# EAGLE design openSX70_EDWIN_V7-9-1_20191127-TSL237T (EAGLE 9.5.1)
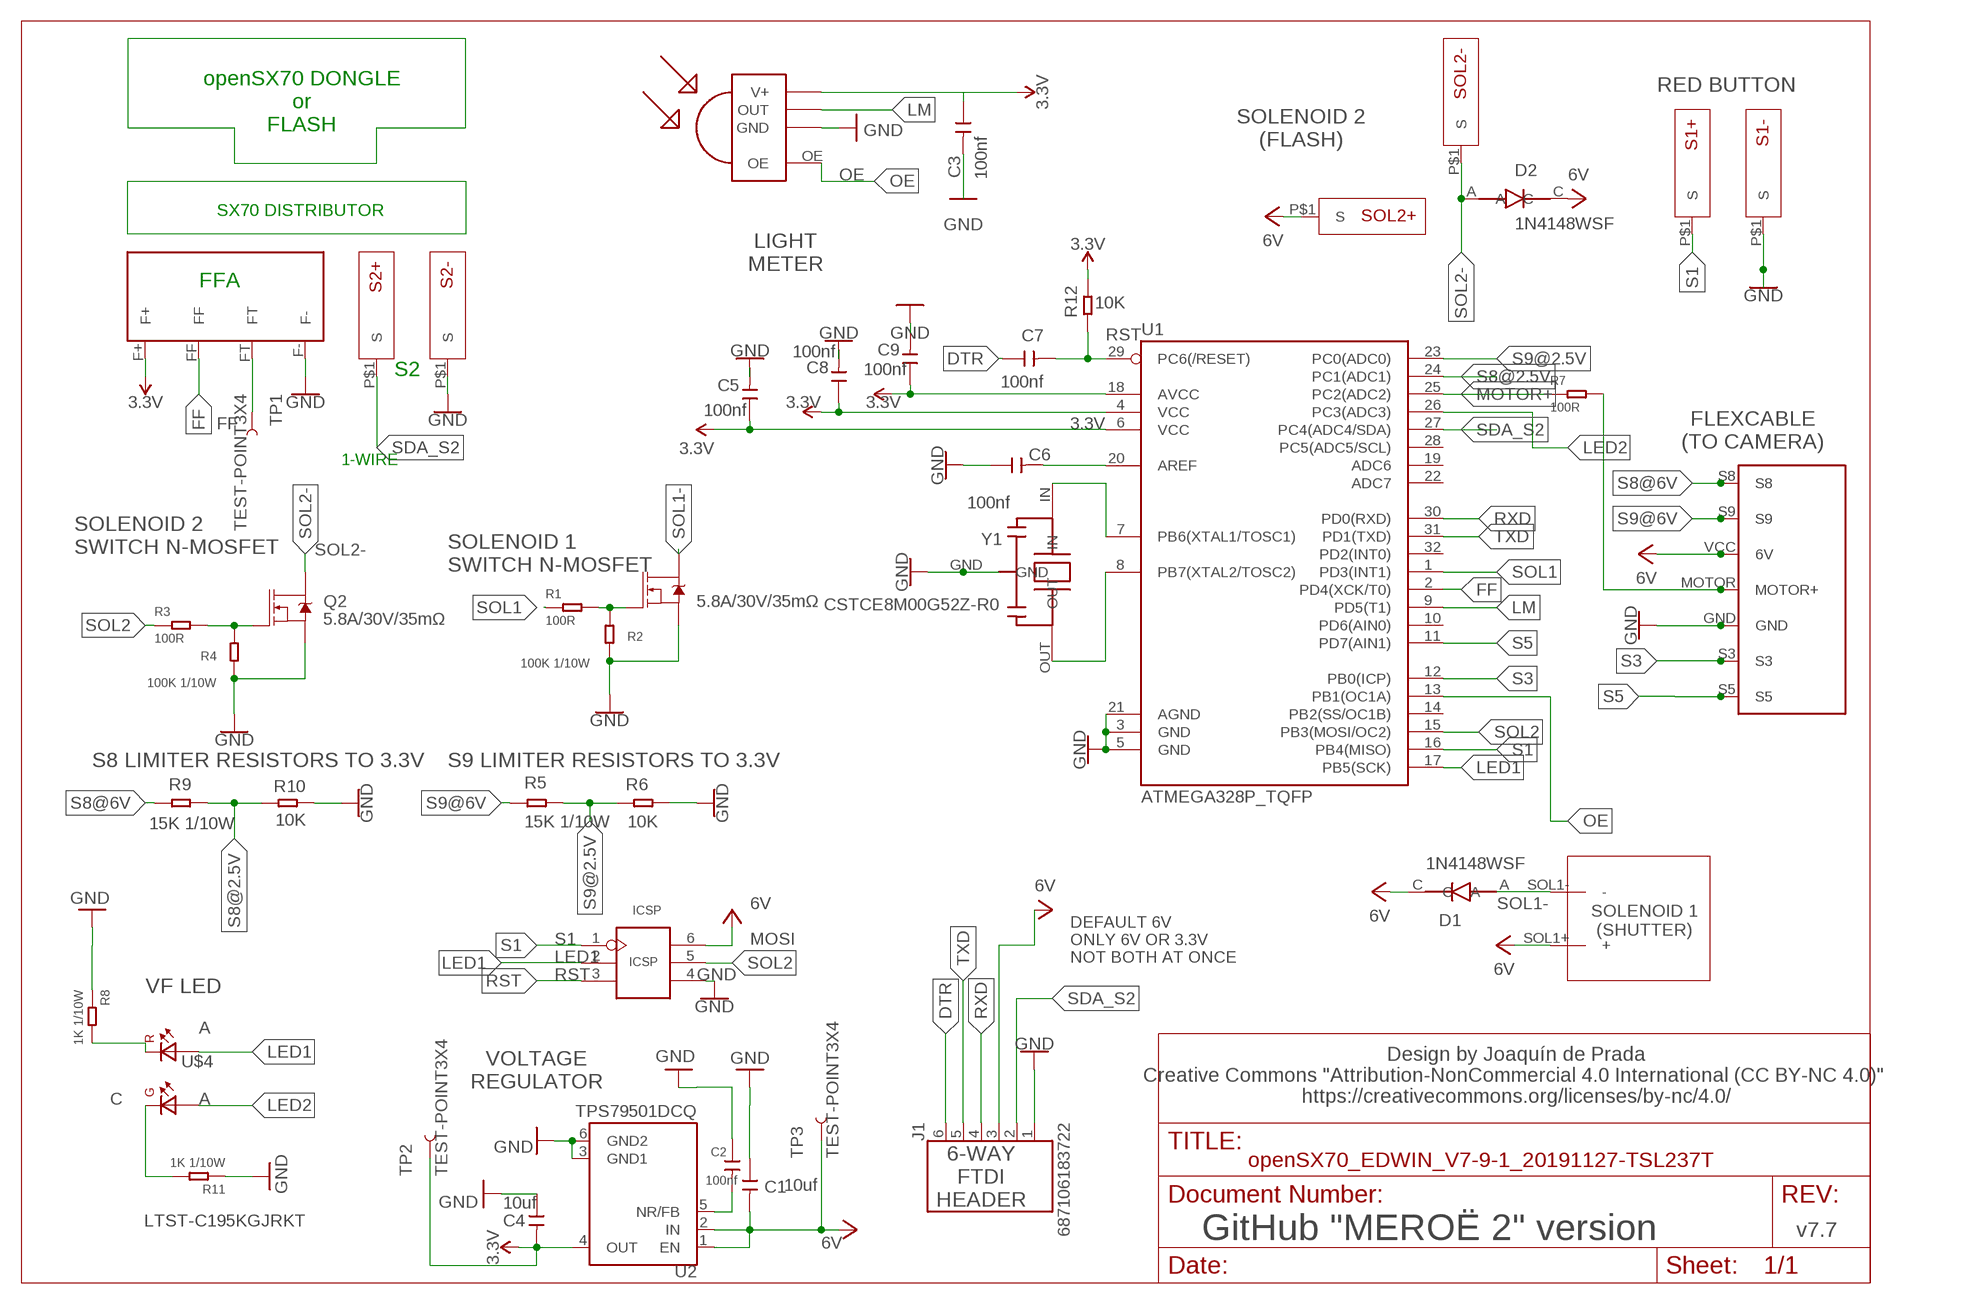
[diagram p0: schematic, sheet 1]

## Parts
C1  10uf  CERAMIC-10UF-10V-10%-X5R(0603)  [C0603]
C2  100nf  CERAMIC-100NF-50V-10%-X7R(0603)  [C0603]
C3  100nf  CERAMIC-100NF-50V-10%-X7R(0603)  [C0603]
C4  10uf  CERAMIC-10UF-10V-10%-X5R(0603)  [C0603]
C5  100nf  CERAMIC-100NF-50V-10%-X7R(0603)  [C0603]
C6  100nf  CERAMIC-100NF-50V-10%-X7R(0603)  [C0603]
C7  100nf  CERAMIC-100NF-50V-10%-X7R(0603)  [C0603]
C8  100nf  CERAMIC-100NF-50V-10%-X7R(0603)  [C0603]
C9  100nf  CERAMIC-100NF-50V-10%-X7R(0603)  [C0603]
D1  1N4148WSF  1N4148WS  [SODFL2512X100N]
D2  1N4148WSF  1N4148WS  [SODFL2512X100N]
ICSP  ICSP  [H2X3-2.54]
J1  687106183722  [687106183722]
Q1  5.8A/30V/35mΩ  MOSFET-NCH-AO3404A  [SOT23-3]
Q2  5.8A/30V/35mΩ  MOSFET-NCH-AO3404A  [SOT23-3]
R1  100R  SMD-RES-100R-5%-1/10W(0603)  [R0603]
R2  100K 1/10W  SMD-RES-100K-5%-1/10W(0603)  [R0603]
R3  100R  SMD-RES-100R-5%-1/10W(0603)  [R0603]
R4  100K 1/10W  SMD-RES-100K-5%-1/10W(0603)  [R0603]
R5  15K 1/10W  SMD-RES-15K-1%-1/10W(0603)  [R0603]
R6  10K  SMD-RES-10K-1%-1/10W(0603)  [R0603]
R7  100R  SMD-RES-100R-5%-1/10W(0603)  [R0603]
R8  1K 1/10W  SMD-RES-1K-5%-1/10W(0603)  [R0603]
R9  15K 1/10W  SMD-RES-15K-1%-1/10W(0603)  [R0603]
R10  10K  SMD-RES-10K-1%-1/10W(0603)  [R0603]
R11  1K 1/10W  SMD-RES-1K-5%-1/10W(0603)  [R0603]
R12  10K  SMD-RES-10K-1%-1/10W(0603)  [R0603]
S1+  SX70-S-PAD-NEW  [SX70-S-PAD2]
S1-  SX70-S-PAD-NEW  [SX70-S-PAD2]
S2+  SX70-S-PAD-NEW  [SX70-S-PAD2]
S2-  SX70-S-PAD-NEW  [SX70-S-PAD2]
SOL1  SX70-SOLENOID1-2PADS  [SX70-SOLENOID1-2]
SOL2+  SX70-S-PAD-NEW  [SX70-S-PAD2]
SOL2-  SX70-S-PAD-NEW  [SX70-S-PAD2]
TP1  TEST-POINT3X4  [PAD.03X.04]
TP2  TEST-POINT3X4  [PAD.03X.04]
TP3  TEST-POINT3X4  [PAD.03X.04]
U1  ATMEGA328P_TQFP  [TQFP32-08]
U2  TPS79501DCQ  [SOT127P706X180-6N]
U$1  SX70-7-PAD  [SX70-7-PAD-PROPER]
U$2  FFA  SX70-FFA-PAD  [FFA-PAD-PACKAGE]
U$3  TSL237T  [TSL237T]
U$4  LTST-C195KGJRKT  [LTST-BILED-15X16]
Y1  CSTCE8M00G52Z-R0  CSTCE16M0V53-R0  [CFP95P160X100-3N]

## Nets
3.3V: C3.1 C4.2 C5.1 C8.1 C9.1 R12.2 TP2.P$1 U1.4(VCC) U1.6(VCC) U1.18(AVCC) U2.4(OUT) U$2.F+ U$3.VDD(V+)
6V: C1.2 D1.C D2.C ICSP.6(VCC) J1.3 SOL1.SOL1+(+) SOL2+.P$1(S) TP3.P$1 U2.1(EN) U2.2(IN) U$1.VCC(6V)
DTR: C7.1 J1.6
FF: U1.2(PD4(XCK/T0)) U$2.FF
GND: C1.1 C2.1 C3.2 C4.1 C5.2 C6.1 C8.2 C9.2 ICSP.4(GND) J1.1 Q1.2(S) Q2.2(S) R2.1 R4.1 R6.2 R8.1 R10.2 R11.1 S1-.P$1(S) S2-.P$1(S) U1.3(GND) U1.5(GND) U1.21(AGND) U2.3(GND1) U2.6(GND2) U$1.GND U$2.F- U$3.GND Y1.GND
LED1: ICSP.2(SCK) U1.17(PB5(SCK)) U$4.P$2(A2)
LED2: U1.26(PC3(ADC3)) U$4.P$1(A1)
LM: U1.9(PD5(T1)) U$3.OUT
MOTOR+: R7.1 U1.25(PC2(ADC2))
MOTOR-HEADER: R7.2 U$1.MOTOR(MOTOR+)
N$1: Q1.1(G) R1.2 R2.2
N$2: C6.2 U1.20(AREF)
N$3: Q2.1(G) R3.2 R4.2
N$4: U1.7(PB6(XTAL1/TOSC1)) Y1.IN
N$5: TP1.P$1 U$2.FT
N$6: U1.8(PB7(XTAL2/TOSC2)) Y1.OUT
N$7: R8.2 U$4.P$4(K2)
N$10: C2.2 U2.5(NR/FB)
N$11: R11.2 U$4.P$3(K1)
OE: U1.13(PB1(OC1A)) U$3.OE
RST: C7.2 ICSP.3(RST) R12.1 U1.29(PC6(/RESET))
RXD: J1.4 U1.30(PD0(RXD))
S1: ICSP.1(MISO) S1+.P$1(S) U1.16(PB4(MISO))
S3: U1.12(PB0(ICP)) U$1.S3
S5: U1.11(PD7(AIN1)) U$1.S5
S8@2.5V: R9.2 R10.1 U1.24(PC1(ADC1))
S8@6V: R9.1 U$1.S8
S9@2.5V: R5.2 R6.1 U1.23(PC0(ADC0))
S9@6V: R5.1 U$1.S9
SDA_S2: J1.2 S2+.P$1(S) U1.27(PC4(ADC4/SDA))
SOL1: R1.1 U1.1(PD3(INT1))
SOL1-: D1.A Q1.3(D) SOL1.SOL1-(-)
SOL2: ICSP.5(MOSI) R3.1 U1.15(PB3(MOSI/OC2))
SOL2-: D2.A Q2.3(D) SOL2-.P$1(S)
TXD: J1.5 U1.31(PD1(TXD))
Unconnected: U1.10(PD6(AIN0)) U1.14(PB2(SS/OC1B)) U1.19(ADC6) U1.22(ADC7) U1.28(PC5(ADC5/SCL)) U1.32(PD2(INT0))

## Notes on the sheet
- RED BUTTON
- openSX70 DONGLE
  or
  FLASH
- SOLENOID 2
  (FLASH)
- SX70 DISTRIBUTOR
- LIGHT
  METER
- FFA
- S2
- FLEXCABLE
  (TO CAMERA)
- 1-WIRE
- SOLENOID 2
  SWITCH N-MOSFET
- SOLENOID 1
  SWITCH N-MOSFET
- S8 LIMITER RESISTORS TO 3.3V | S9 LIMITER RESISTORS TO 3.3V
- SOLENOID 1
  (SHUTTER)
- MOSI
- DEFAULT 6V
  ONLY 6V OR 3.3V
  NOT BOTH AT ONCE
- VF LED
- A
- VOLTAGE
  REGULATOR
- Design by Joaquín de Prada
  Creative Commons "Attribution-NonCommercial 4.0 International (CC BY-NC 4.0)" 
  https://creativecommons.org/licenses/by-nc/4.0/
- C | A
- 6-WAY
  FTDI
  HEADER
- v7.7
- GitHub "MEROË 2" version

## Library data of the parts
C1 C4 = Seeed-Capacitor:CERAMIC-10UF-10V-10%-X5R(0603): 302010103; MPN: CC0603KRX5R6BB106
C2 C3 C5-C9 = Seeed-Capacitor:CERAMIC-100NF-50V-10%-X7R(0603): 302010138; MPN: CC0603KRX7R9BB104
D1 D2 = Common-Parts-Library-Eagle:1N4148WS: 1N4148WS Series 75 V 300 mA Surface Mount Small Signal Diodes - SOD-323F; MANUFACTURER: Fairchild Semiconductor
ICSP = openSX70:ICSP
J1 = 687106183722:687106183722: 687106183722 WR-FPC 0.50mm SMT Horizontal Bottom Contact - Low Profile <http://katalog.we-online.de/media/images/v2/Family_WR-FPC_6871xx183722.jpg> Details see: http://katalog.we-online.de/en/em/FPC_0_5_SMT_ZIF_HORIZONTAL_BOTTOM_CONTACT_LOW_PROFILE_6871xx183722 Created by Yingchun,shan 2016 (C) Wurth Elektronik; AVAILABILITY: Good; DESCRIPTION: CONN FFC BTM 6POS 0.5MM SMD R/A; MF: Wurth Electronics; MP: 687106183722; PACKAGE: None; PRICE: 1.21 USD
Q1 Q2 = openSX70:MOSFET-NCH: N-channel MOSFETs Voltage controlled devices that allow control of high current outputs. SparkFun Products: SparkFun OpenScale <https://www.sparkfun.com/products/13261> SparkFun Digital Sandbox <https://www.sparkfun.com/products/12651> SparkFun Monster Moto Shield <https://www.sparkfun.com/products/10182> SparkFun MOSFET Power Controller <https://www.sparkfun.com/products/11214>; PROD_ID: TRANS-12988
R1 R3 R7 = Seeed-Resistor:SMD-RES-100R-5%-1/10W(0603): 301010090; MPN: RC0603JR-07100RL
R2 R4 = Seeed-Resistor:SMD-RES-100K-5%-1/10W(0603): 301010089; MPN: RC0603JR-07100KL
R5 R9 = Seeed-Resistor:SMD-RES-15K-1%-1/10W(0603): 301010241; MPN: RC0603FR-0715KL
R6 R10 R12 = Seeed-Resistor:SMD-RES-10K-1%-1/10W(0603): 301010299; MPN: RC0603FR-0710KL
R8 R11 = Seeed-Resistor:SMD-RES-1K-5%-1/10W(0603): 301010291; MPN: RC0603JR-071KL
S1+ S1- S2+ S2- SOL2+ SOL2- = openSX70:SX70-S-PAD-NEW
SOL1 = openSX70:SX70-SOLENOID1-2PADS
TP1-TP3 = SparkFun-Connectors:TEST-POINT: SparkFun Test Points Bare copper test points for troubleshooting or In-Circuit-Testing. These are used by our Production team for verifying production board runs using pogo-pins on test beds. SparkFun Products: SparkFun LSM9DS1 Breakout <https://www.sparkfun.com/products/13284> SparkFun PSOC <https://www.sparkfun.com/products/13714> SparkFun Load Cell Amplifier <https://www.sparkfun.com/products/13879>
U1 = openSX70:ATMEGA328P_TQFP: Popular 328P in QFP Storefront component: ATmega328 - TQFP <https://www.sparkfun.com/products/13448> (COM-13448) Datasheet <http://www.sparkfun.com/datasheets/Components/SMD/ATMega328.pdf> SparkFun Products SparkFun RedBoard - Programmed with Arduino <https://www.sparkfun.com/products/12757> (DEV-12757) Arduino Pro Mini 328 - 5V/16MHz <https://www.sparkfun.com/products/11113> (DEV-11113) Arduino Pro Mini 328 - 3.3V/8MHz <https://www.sparkfun.com/products/11114> (DEV-11114) SparkFun OpenLog <https://www.sparkfun.com/products/13712> (DEV-13712) SparkFun MicroView - OLED Arduino Module <https://www.sparkfun.com/products/12923> (DEV-12923) SparkFun Digital Sandbox <https://www.sparkfun.com/products/12651> (DEV-12651) SparkFun PicoBoard <https://www.sparkfun.com/products/11888> (WIG-11888) Arduino Fio <https://www.sparkfun.com/products/10116> (DEV-10116) LilyPad Arduino 328 Main Board <https://www.sparkfun.com/products/13342> (DEV-13342) SparkFun RedStick <https://www.sparkfun.com/products/13741> (DEV-13741) LilyPad MP3 <https://www.sparkfun.com/products/11013> (DEV-11013) LilyPad Arduino SimpleSnap <https://www.sparkfun.com/products/10941> (DEV-10941) SparkFun Stepoko <https://www.sparkfun.com/products/13899> (ROB-13899) SparkFun Geiger Counter <https://www.sparkfun.com/products/11345> (SEN-11345) SparkFun EL Sequencer <https://www.sparkfun.com/products/12781> (COM-12781) Arduino Pro 328 - 5V/16MHz <https://www.sparkfun.com/products/10915> (DEV-10915) CryptoCape <https://www.sparkfun.com/products/12773> (DEV-12773) SparkFun IR Thermometer Evaluation Board - MLX90614 <https://www.sparkfun.com/products/10740> (SEN-10740) SparkFun RedBot Mainboard <https://www.sparkfun.com/products/12097> (ROB-12097) Arduino Pro 328 - 3.3V/8MHz <https://www.sparkfun.com/products/10914> (DEV-10914) SparkFun Block for Intel® Edison - Arduino <https://www.sparkfun.com/products/13036> (DEV-13036) SparkFun Simon Says - Surface Mount Soldering Kit <https://www.sparkfun.com/products/10935> (KIT-10935) SparkFun 7-Segment Serial Display - Red <https://www.sparkfun.com/products/11441> (COM-11441) SparkFun 7-Segment Serial Display - White <https://www.sparkfun.com/products/11629> (COM-11629) SparkFun 7-Segment Serial Display - Yellow <https://www.sparkfun.com/products/11443> (COM-11443) SparkFun 7-Segment Serial Display - Kelly Green <https://www.sparkfun.com/products/11440> (COM-11440) SparkFun 7-Segment Serial Display - Blue <https://www.sparkfun.com/products/11442> (COM-11442) SparkFun OpenSegment Serial Display - 20mm (Blue) <https://www.sparkfun.com/products/11647> (COM-11647) SparkFun OpenSegment Serial Display - 20mm (Green) <https://www.sparkfun.com/products/11646> (COM-11646) SparkFun OpenSegment Serial Display - 20mm (White) <https://www.sparkfun.com/products/11648> (COM-11648) SparkFun OpenSegment Serial Display - 20mm (Red) <https://www.sparkfun.com/products/11644> (COM-11644) SparkFun OpenSegment Serial Display - 20mm (Yellow) <https://www.sparkfun.com/products/11645> (COM-11645) SparkFun OpenSegment Shield <https://www.sparkfun.com/products/13190> (DEV-13190); PROD_ID: IC-09069
U2 = TPS79501DCQ:TPS79501DCQ: Ultralow-Noise, High-PSRR, Fast, RF, 500-mA Low-Dropout Linear Regulators 6-SOT-223 -40 to 125; DESCRIPTION: Ultralow-Noise, High-PSRR, Fast, RF, 500-mA Low-Dropout Linear Regulators 6-SOT-223 -40 to 125; DIGI-KEY_PART_NUMBER: 296-27102-5-ND; DIGI-KEY_PURCHASE_URL: https://www.digikey.com/product-detail/en/texas-instruments/TPS79501DCQ/296-27102-5-ND/1908443?utm_source=snapeda&utm_medium=aggregator&utm_campaign=symbol; MF: Texas Instruments; MP: TPS79501DCQ; PACKAGE: SOT-223-6 Texas Instruments
U$1 = _openSX70:SX70-7-PAD
U$2 = openSX70:SX70-FFA-PAD
U$3 = _openSX70:TSL237T
U$4 = LTST-C195KGJRKT:LTST-C195KGJRKT; AVAILABILITY: Unavailable; DESCRIPTION: Green/Red 130° Water Clear 35/25 mcd 2 V 0605 Surface Mount Bi-Color LED; MF: Lite-On Inc.; MP: LTST-C195KGJRKT; PACKAGE: 0606 Lite-On; PRICE: None
Y1 = CSTCE16M0V53-R0:CSTCE16M0V53-R0: Ceramic Resonator 16MHz ±0.5% (Tol) ±0.3% (Stability) 15pF 40Ohm 3-Pin CSMD T/R; AVAILABILITY: Good; DESCRIPTION: Ceramic Resonator 16MHz ??0.5% (Tol) ??0.3% (Stability) 15pF 40Ohm 3-Pin CSMD T/R; MF: Murata; MP: CSTCE16M0V53-R0; PACKAGE: SMD-3 Murata; PRICE: 0.28 USD

## Net classes
0 default: width 0.254 mm
1 GND: width 0.61 mm

## Board
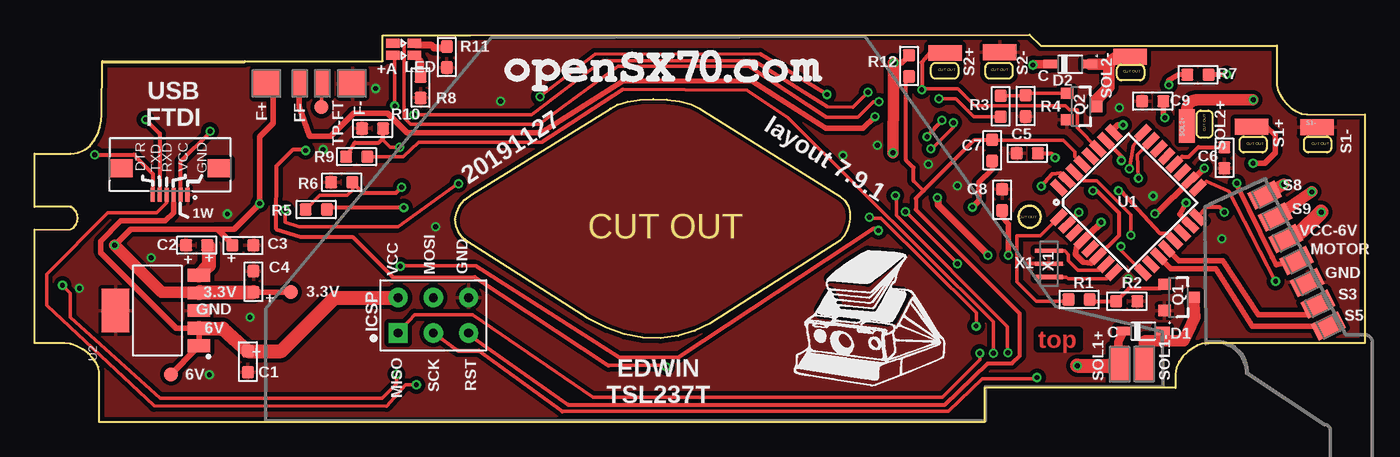
[diagram p1: board, top side]
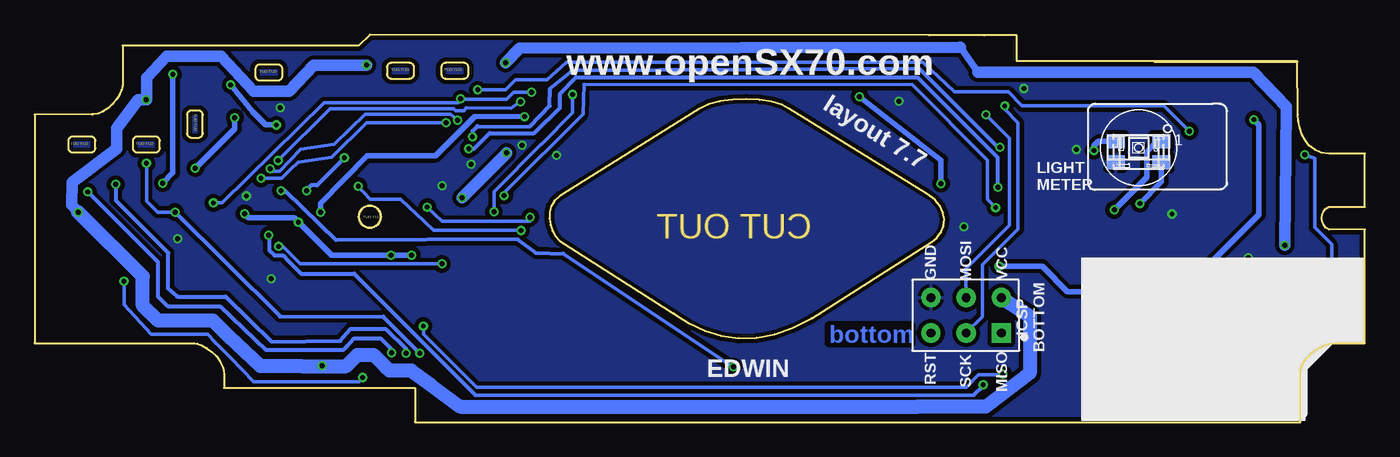
[diagram p2: board, bottom side, seen from below]

Size 95.88 x 27.91 mm. Coordinates in mm from the lower left corner, seen from the top.
Outline: 71.72,15.6 71.88,15.58 72.03,15.53 72.17,15.46 72.29,15.36
Outline: 72.29,15.36 72.39,15.24 72.46,15.11 72.51,14.96 72.52,14.79
Outline: 72.52,14.79 72.51,14.63 72.46,14.48 72.39,14.35 72.29,14.23
Outline: 72.29,14.23 72.17,14.13 72.03,14.06 71.88,14.01 71.72,14
Outline: 71.72,14 71.56,14.01 71.41,14.06 71.28,14.13 71.16,14.23
Outline: 71.16,14.23 71.06,14.35 70.99,14.48 70.94,14.63 70.92,14.79
Outline: 70.92,14.79 70.94,14.96 70.99,15.11 71.06,15.24 71.16,15.36
Outline: 71.16,15.36 71.28,15.46 71.41,15.53 71.56,15.58 71.72,15.6
Outline: 71.72,15.6 71.57,15.58 71.42,15.53 71.28,15.46 71.16,15.36
Outline: 71.16,15.36 71.06,15.24 70.98,15.1 70.94,14.95 70.92,14.79
Outline: 70.92,14.79 70.94,14.64 70.98,14.49 71.06,14.35 71.16,14.23
Outline: 71.16,14.23 71.28,14.13 71.42,14.06 71.57,14.01 71.72,14
Outline: 71.72,14 71.88,14.01 72.03,14.06 72.17,14.13 72.29,14.23
Outline: 72.29,14.23 72.39,14.35 72.46,14.49 72.51,14.64 72.52,14.79
Outline: 72.52,14.79 72.51,14.95 72.46,15.1 72.39,15.24 72.29,15.36
Outline: 72.29,15.36 72.17,15.46 72.03,15.53 71.88,15.58 71.72,15.6
Outline: 91.7,22.16 91.77,22.16 95.88,22.16 95.88,5.69 84.4,5.69 84.15,5.65 83.83,5.52 83.48,5.32 83.11,5.06 82.78,4.73 82.5,4.35 82.31,3.92 82.24,3.45 82.24,2.46 68.48,2.46 68.48,0 4.65,0 4.65,3.65 4.59,3.95 4.43,4.28 4.17,4.61 3.85,4.94 3.46,5.23 3.04,5.47 2.59,5.63 2.14,5.69 0,5.69 0,13.87 2.59,13.89 2.81,14.01 2.98,14.2 3.07,14.44 3.1,14.7 3.07,14.96 2.97,15.2 2.81,15.39 2.59,15.51 0,15.51 0,19.34 2.59,19.34 3.14,19.41 3.6,19.61 3.99,19.92 4.3,20.31 4.53,20.75 4.7,21.22 4.79,21.7 4.82,22.16 4.87,25.98 15.15,25.98 15.1,25.99 25.09,26 25.09,27.86 27.43,27.87 31.39,27.87 71.71,27.91 72.52,27.12 89.55,27.12 89.55,24.26 89.61,23.95 89.76,23.61 89.97,23.26 90.25,22.92 90.57,22.62 90.93,22.38 91.31,22.22 91.7,22.16
Outline: 83.76,20.82 83.76,22.11 83.77,22.17 83.79,22.24 83.82,22.29 83.86,22.34 83.91,22.38 83.96,22.41 84.03,22.43 84.09,22.44 84.57,22.44 84.64,22.43 84.7,22.41 84.76,22.38 84.81,22.34 84.85,22.29 84.88,22.24 84.9,22.17 84.9,22.11 84.9,20.82 84.9,20.75 84.88,20.69 84.85,20.63 84.81,20.58 84.76,20.54 84.7,20.51 84.64,20.49 84.57,20.49 84.09,20.49 84.03,20.49 83.96,20.51 83.91,20.54 83.86,20.58 83.82,20.63 83.79,20.69 83.77,20.75 83.76,20.82
Outline: 87.19,20.58 88.48,20.58 88.54,20.57 88.61,20.55 88.66,20.52 88.71,20.48 88.75,20.43 88.78,20.37 88.8,20.31 88.81,20.24 88.81,19.76 88.8,19.7 88.78,19.64 88.75,19.58 88.71,19.53 88.66,19.49 88.61,19.46 88.54,19.44 88.48,19.43 87.19,19.43 87.12,19.44 87.06,19.46 87,19.49 86.95,19.53 86.91,19.58 86.88,19.64 86.86,19.7 86.86,19.76 86.86,20.24 86.86,20.31 86.88,20.37 86.91,20.43 86.95,20.48 87,20.52 87.06,20.55 87.12,20.57 87.19,20.58
Outline: 91.84,20.58 93.13,20.58 93.2,20.57 93.26,20.55 93.32,20.52 93.37,20.48 93.41,20.43 93.44,20.37 93.46,20.31 93.46,20.24 93.46,19.76 93.46,19.7 93.44,19.64 93.41,19.58 93.37,19.53 93.32,19.49 93.26,19.46 93.2,19.44 93.13,19.43 91.84,19.43 91.78,19.44 91.71,19.46 91.66,19.49 91.61,19.53 91.57,19.58 91.54,19.64 91.52,19.7 91.51,19.76 91.51,20.24 91.52,20.31 91.54,20.37 91.57,20.43 91.61,20.48 91.66,20.52 91.71,20.55 91.78,20.57 91.84,20.58
Outline: 78.36,25.76 79.65,25.76 79.71,25.75 79.78,25.73 79.83,25.7 79.88,25.66 79.92,25.61 79.95,25.55 79.97,25.49 79.98,25.42 79.98,24.95 79.97,24.88 79.95,24.82 79.92,24.76 79.88,24.71 79.83,24.67 79.78,24.64 79.71,24.62 79.65,24.61 78.36,24.61 78.29,24.62 78.23,24.64 78.17,24.67 78.12,24.71 78.08,24.76 78.05,24.82 78.03,24.88 78.02,24.95 78.02,25.42 78.03,25.49 78.05,25.55 78.08,25.61 78.12,25.66 78.17,25.7 78.23,25.73 78.29,25.75 78.36,25.76
Outline: 68.87,25.89 70.16,25.89 70.23,25.88 70.29,25.86 70.35,25.83 70.39,25.79 70.43,25.74 70.47,25.68 70.49,25.62 70.49,25.56 70.49,25.08 70.49,25.01 70.47,24.95 70.43,24.89 70.39,24.84 70.35,24.8 70.29,24.77 70.23,24.75 70.16,24.74 68.87,24.74 68.8,24.75 68.74,24.77 68.68,24.8 68.64,24.84 68.59,24.89 68.56,24.95 68.54,25.01 68.54,25.08 68.54,25.56 68.54,25.62 68.56,25.68 68.59,25.74 68.64,25.79 68.68,25.83 68.74,25.86 68.8,25.88 68.87,25.89
Outline: 64.95,25.89 66.24,25.89 66.31,25.88 66.37,25.86 66.43,25.83 66.48,25.79 66.52,25.74 66.55,25.68 66.57,25.62 66.57,25.56 66.57,25.08 66.57,25.01 66.55,24.95 66.52,24.89 66.48,24.84 66.43,24.8 66.37,24.77 66.31,24.75 66.24,24.74 64.95,24.74 64.88,24.75 64.82,24.77 64.77,24.8 64.72,24.84 64.68,24.89 64.65,24.95 64.63,25.01 64.62,25.08 64.62,25.56 64.63,25.62 64.65,25.68 64.68,25.74 64.72,25.79 64.77,25.83 64.82,25.86 64.88,25.88 64.95,25.89
Outline: 31.52,16.4 41.5,22.58 42.01,22.87 42.74,23.08 43.62,23.21 44.59,23.26 45.57,23.23 46.5,23.11 47.32,22.89 47.95,22.58 58.05,16.28 58.41,15.95 58.64,15.56 58.76,15.12 58.78,14.66 58.71,14.21 58.56,13.78 58.34,13.39 58.06,13.08 49.78,7.82 48.71,7.1 47.57,6.56 46.38,6.21 45.13,6.04 43.84,6.08 42.53,6.33 41.2,6.8 39.87,7.5 31.22,12.98 30.83,13.28 30.55,13.67 30.37,14.12 30.32,14.6 30.4,15.09 30.62,15.57 30.99,16.02 31.52,16.4
Copper layers (1*16): Top 0.035mm / dielectric 1.5mm / Bottom 0.035mm
Design rules "SeeedStudio_2layer_DRU_no_angle_20140221": minimum track width 6mil, minimum drill 12mil, track to track 6mil, track to pad 6mil, pad to pad 6mil, via to via 6mil, smd to smd 0mil, copper to edge 10mil, drill to drill 10mil, minimum pad ring 10mil, minimum via ring 6mil, stop-mask expansion 2mil, vias tented up to drill 100mil, thermal gap 10mil
tRestrict: area 57.2,10.1 to 62.6,12.4; area 56.5,7.2 to 62.8,9.5

### Footprints (pad centres in the part's own frame; a part is rotated, then mirrored left to right if it is on the bottom)
C0603 = smd 0.889 x 0.889: 1 0,0.762; 2 0,-0.762
SODFL2512X100N = smd 1.05 x 0.6: A 1.4,0; C -1.4,0
H2X3-2.54 = drill 0.635 pad 1.397 square: 1 -1.27,2.54 | drill 0.635 pad 1.397: 2 -1.27,0; 3 -1.27,-2.54; 4 1.27,-2.54; 5 1.27,0; 6 1.27,2.54
687106183722 = smd 0.3 x 1: 1 -1.25,1.9; 2 -0.75,1.9; 3 -0.25,1.9; 4 0.25,1.9; 5 0.75,1.9; 6 1.25,1.9 | smd 1.65 x 1.3: Z1 -3.525,0; Z2 3.525,0
SOT23-3 = smd 0.8 x 0.9: 1 -0.95,-1; 2 0.95,-1; 3 0,1.1
R0603 = smd 0.889 x 0.889: 1 0,0.762; 2 0,-0.762
SX70-S-PAD2 = smd 2.413 x 1.143: P$1 0.01,0.087
SX70-SOLENOID1-2 = smd 1.372 x 2.54: SOL1+ -0.826,0.127; SOL1- 0.953,0.127
PAD.03X.04 = smd 1.016 x 1.016: P$1 0,0
TQFP32-08 = smd 1.27 x 0.559: 1 -4.293,2.8; 2 -4.293,2; 3 -4.293,1.2; 4 -4.293,0.4; 5 -4.293,-0.4; 6 -4.293,-1.2; 7 -4.293,-2; 8 -4.293,-2.8; 17 4.293,-2.8; 18 4.293,-2; 19 4.293,-1.2; 20 4.293,-0.4; 21 4.293,0.4; 22 4.293,1.2; 23 4.293,2; 24 4.293,2.8 | smd 0.559 x 1.27: 9 -2.8,-4.293; 10 -2,-4.293; 11 -1.2,-4.293; 12 -0.4,-4.293; 13 0.4,-4.293; 14 1.2,-4.293; 15 2,-4.293; 16 2.8,-4.293; 25 2.8,4.293; 26 2,4.293; 27 1.2,4.293; 28 0.4,4.293; 29 -0.4,4.293; 30 -1.2,4.293; 31 -2,4.293; 32 -2.8,4.293
SOT127P706X180-6N = smd 0.92 x 1.61: 1 -2.54,-3.005; 2 -1.27,-3.005; 3 0,-3.005; 4 1.27,-3.005; 5 2.54,-3.005 | smd 3.16 x 1.97: 6 0,3.005
SX70-7-PAD-PROPER = smd 1.31 x 2.159: GND 7.875,1.312; MOTOR 6.125,1.312; S3 9.625,1.312; S5 11.375,1.312; S8 0.875,1.312; S9 2.625,1.312; VCC 4.375,1.312
FFA-PAD-PACKAGE = smd 1.95 x 1.95: F+ -3.277,-0.013; F- 2.87,0 | smd 1.05 x 1.95: FF -0.914,0; FT 0.737,0.025
TSL237T = smd 1.3 x 1: GND -1.597,-1.016; OE -1.597,0.484; OUT 1.703,0.484; VDD 1.703,-1.016
LTST-BILED-15X16 = smd 0.65 x 0.952: P$1 0.425,0.776; P$2 -0.425,0.776; P$3 0.425,-0.776; P$4 -0.425,-0.776
CFP95P160X100-3N = smd 0.3 x 2.032: GND 0.038,0.175; IN -0.912,0.177; OUT 0.992,0.174

### Placement (x,y rotation side)
C1  15.37,4.35 180 top
C2  11.67,12.75 90 top
C3  15.01,12.73 90 top
C4  15.77,10.12 0 top
C5  71.55,19.36 270 top
C6  85.76,19.05 180 top
C7  69.02,19.58 180 top
C8  69.75,16.01 180 top
C9  80.59,23.12 270 top
D1  79.91,6.56 0 top
D2  74.65,25.79 0 top
ICSP  28.74,7.69 90 top
J1  9.77,18.28 180 top
Q1  82.43,8.99 270 top
Q2  75.41,22.74 270 top
R1  75.28,8.83 90 top
R2  78.72,8.71 270 top
R3  69.64,22.76 180 top
R4  71.43,22.78 180 top
R5  20.29,15.31 270 top
R6  22.14,17.28 270 top
R7  83.86,25.03 90 top
R8  27.81,24.11 180 top
R9  23.21,19.12 270 top
R10  24.36,21.15 270 top
R11  29.7,26.31 180 top
R12  63.03,25.66 180 top
S1+  87.72,21.19 0 top
S1-  92.42,21.14 0 top
S2+  65.62,26.51 0 top
S2-  69.56,26.56 0 top
SOL1  79.03,4.1 0 top
SOL2+  83.14,21.33 90 top
SOL2-  78.96,26.24 0 top
TP1  20.67,22.69 0 top
TP2  18.46,9.36 0 top
TP3  9.83,3.44 0 top
U1  78.84,15.82 45 top
U2  8.84,8.03 90 top
U$1  87.1,16.57 296 top
U$2  20.04,24.39 0 top
U$3  16.36,19.74 0 bottom
U$4  26.59,26.86 90 top
Y1  72.94,11.44 270 top

### Tracks (layer width: path | path; a pad name or v marks a point on that pad's centre or on a via)
3.3V  (via drill 0.35)
  Top 0.305: C5.1 73.28,19.36 73.58,19.06 v73.56,19.03 | v76.28,16.67 76.55,16.67 78.15,15.07 78.15,13.44 U1.6 76.16,11.44
  Top 0.406: U1.4 75.08,12.56 75.02,12.09 75.6,11.5 76.16,11.44 | R12.2 62.51,25.9 v61.93,25.9 | C4.2 TP2.P$1 | U$2.F+ 17.19,23.95 17.19,21.55 16.22,20.57 v16.22,15.74 14.38,13.91 13.18,13.91 | 13.18,13.91 13.07,13.91 6.94,13.91 v5.76,12.73 | v84.3,18.3 83.45,17.44 U1.18 80.87,15.02 v80.75,15.02 | v81.46,21.93 81.36,22.03 C9.1 | v70.18,12.02 70.21,12.05 70.21,14.28 69.75,14.74 C8.1 | 13.18,13.91 14.25,12.84 C3.1
  Top 0.508: U1.4 76.84,14.3 v76.87,14.4 | v65.09,16.17 65.11,16.17 65.11,15.65 68.71,12.05 v68.71,12.02
  Top 0.813: v61.87,19.4 61.87,19.58 61.87,19.57 61.91,23.79 61.91,25.88 v61.93,25.9 | v5.76,12.73 v5.76,12.74 9.14,9.36 11.91,9.36
  Top 1.016: U2.4 11.86,9.3 11.91,9.36 C4.2
  Bottom 0.305: v73.56,19.03 75.54,17.05 75.94,17.05 76.33,16.67 v76.28,16.67
  Bottom 0.406: v80.75,15.02 80.44,14.71 77.19,14.71 v76.87,14.4 76.85,14.4 74.48,12.02 v70.18,12.02 v68.71,12.02 | v84.3,18.3 81.46,21.14 v81.46,21.93 | U$3.VDD 14.65,17.31 v16.22,15.74
  Bottom 0.508: 29.15,26.99 27.88,25.21
  Bottom 0.813: v5.76,12.73 5.68,22.73 8.02,25.2 27.88,25.21 | v61.93,25.9 60.92,26.92 29.15,26.99 | v65.09,16.17 61.87,19.39 v61.87,19.4
6V  (via drill 0.35)
  Top 0.254: 87.79,23.22 v87.84,23.22 | J1.3 10.02,15.76
  Top 0.406: TP3.P$1 11.66,5.27 11.66,5.49 U2.1 U2.2 10.21,6.76 4.77,12.21 4.77,13.04 6.21,14.49 9.42,14.49 10.02,15.09 10.02,15.76
  Top 0.61: v71.95,25.73 arc-90 72.01,25.79 D2.C | SOL1.SOL1+ 78.11,5.79 D1.C
  Top 0.813: SOL2+.P$1 83.05,22.47 arc-90 83.79,23.22 87.79,23.22
  Top 1.016: v75.16,4.06 77.95,4.07 SOL1.SOL1+ | 92.72,15.12 v92.75,15.12 | ICSP.6 21.63,8.96 17.78,5.12 C1.2 13.55,6.74 U2.2
  Top 1.067: U$1.VCC 91.31,13.75 92.72,15.12
  Bottom 0.254: v87.84,23.22 87.95,23.22 87.79,23.22
  Bottom 0.813: 86.71,7.31 86.97,7.31 | 76.68,4.03 v75.16,4.06 | v71.95,25.73 75.77,25.73 77.55,23.82 80.1,23.82 82.45,26.36 86.37,26.36 87.82,24.81 87.79,23.22 | v92.75,15.12 93.21,15.65 93.19,17.28 89.95,19.69 89.95,21.18 88.44,23.22 v87.84,23.22
  Bottom 1.016: 86.71,7.31 83.03,7.31 81.89,6.17 79.6,4.03 76.68,4.03 73.42,4.03 72.62,4.83 71.46,4.83 70.56,3.94 70.31,3.7 68.74,3.7 67.35,2.7 65.22,1.11 32.2,1.11 27.32,1.11 24.16,3.53 24.14,7.61 ICSP.6 | 86.97,7.31 88.08,8.39 88.08,10.49 v92.75,15.12
DTR  (via drill 0.35)
  Top 0.254: v26.08,3.45 26.08,2.76 25.05,1.73 9.03,1.72 2.56,7.57 2.56,9.3 v2,9.86 | v67.87,6.92 67.87,7.87 60.99,14.69 60.25,14.69 v60.17,14.77
  Top 0.305: v4.33,19.27 7.16,19.27 7.37,19.06 7.37,19.03 8.52,17.88 J1.6
  Top 0.406: C7.1 69.02,18.23 68.06,17.27 68.06,15.96 v67.59,15.49
  Bottom 0.254: v4.33,19.27 3.62,19.03 3.62,14.04 2.38,12.8 2.38,10.24 v2,9.86 | v67.59,15.49 66.53,14.47 60.17,14.49 v60.17,14.77 | v26.08,3.45 26.14,3.4 27.84,3.4 28.71,2.52 64.03,2.52 67.84,6.33 67.84,6.89 v67.87,6.92
FF  (via drill 0.35)
  Top 0.406: U$2.FF 19.07,24.34 19.07,22.73 19.82,20.61 21.33,20.61 22.99,22.26 25.43,22.27 26.86,20.84 36.52,20.84 42.39,24.57 51.66,24.59 57.04,21.18 59.72,21.16 v60.57,22.01 | v75.28,15.12 75.28,15.08 U1.2
  Bottom 0.406: v60.57,22.01 60.58,22.03 64.18,21.99 66.97,19.19 71.92,19.19 75.28,15.78 v75.28,15.12
GND  (via drill 0.35)
  Top 0.305: Y1.GND 71.5,11.41 71.5,11.44
  other vias: 66.52,17.03 85.57,13.22 78.18,22.64 80.62,16.29 28.9,14.08 3.23,9.63 15.52,7.55 8.41,11.84 13.89,14.99 20.8,19.64 60.76,19.95 78.84,10.32 12.6,3.41 33.58,23.12 24.59,24.04 64.41,18.58 58.27,19.21
  pour Top (isolate 0.305): 91.7,22.16 91.77,22.16 95.88,22.16 95.88,5.69 84.4,5.69 84.15,5.65 83.83,5.52 83.48,5.32 83.11,5.06 82.78,4.73 82.5,4.35 82.31,3.92 82.24,3.45 82.24,2.46 68.47,2.46 68.47,0.05 4.17,0.05 4.17,3.66 4.11,3.95 3.94,4.28 3.69,4.61 3.36,4.94 2.98,5.23 2.56,5.47 2.11,5.63 1.66,5.69 0,5.69 0,13.87 2.59,13.89 2.81,14.01 2.98,14.2 3.07,14.44 3.1,14.7 3.07,14.96 2.97,15.2 2.81,15.39 2.59,15.5 0,15.51 0,19.34 2.59,19.34 3.14,19.41 3.6,19.61 3.99,19.92 4.3,20.31 4.53,20.75 4.7,21.22 4.79,21.7 4.82,22.16 4.82,25.99 15.1,25.99 25.28,25.94 25.35,27.91 71.71,27.91 72.52,27.12 89.55,27.12 89.55,24.26 89.61,23.95 89.76,23.61 89.97,23.26 90.25,22.92 90.57,22.62 90.93,22.38 91.31,22.22
  pour Bottom (isolate 0.305): 91.7,22.16 91.77,22.16 95.88,22.16 95.88,5.69 84.4,5.69 84.15,5.65 83.83,5.52 83.48,5.32 83.11,5.06 82.78,4.73 82.5,4.35 82.31,3.92 82.24,3.45 82.24,2.46 68.47,2.46 68.47,0.05 4.17,0.05 4.17,3.66 4.11,3.95 3.94,4.28 3.69,4.61 3.36,4.94 2.98,5.23 2.56,5.47 2.11,5.63 1.66,5.69 0,5.69 0,13.87 2.59,13.89 2.81,14.01 2.98,14.2 3.07,14.44 3.1,14.7 3.07,14.96 2.97,15.2 2.81,15.39 2.59,15.5 0,15.51 0,19.34 2.59,19.34 3.14,19.41 3.6,19.61 3.99,19.92 4.3,20.31 4.53,20.75 4.7,21.22 4.79,21.7 4.82,22.16 4.82,25.85 14.99,25.85 14.98,25.74 25.31,25.85 25.51,27.91 71.71,27.91 72.52,27.12 89.55,27.12 89.55,24.26 89.61,23.95 89.76,23.61 89.97,23.26 90.25,22.92 90.57,22.62 90.93,22.38 91.31,22.22
LED1  (via drill 0.35)
  Top 0.254: v72.26,3.21 72.17,3.12 68.33,3.12 65.88,0.77 38.05,0.77 | U1.17 84.45,17.34 86.08,16.64 v89.45,10.14 | v25.96,22.78 25.93,22.8 25.93,26.31 U$4.P$2
  Top 0.305: ICSP.2 30.5,5.14 32.03,5.14 38.05,0.77
  Bottom 0.254: v72.26,3.21 72.5,2.92 80.1,2.92 81.76,4.62 82.66,5.52 82.88,5.73 83.41,6.33 87.48,6.33 89.45,8.45 v89.45,10.14 | v25.96,22.78 25.96,22.52 25,21.57 25,13.88 27.56,11.33 27.56,7.6 ICSP.2
LED2  (via drill 0.35)
  Top 0.254: v60.86,23.07 60.45,23.07 59.33,21.95 57.08,21.95 51.49,25.62 42.06,25.62 36.36,21.47 27.09,21.47 26.61,21.94 26.61,27.22 26.55,27.28 U$4.P$1
  Top 0.305: U1.26 78.43,19.06 78.43,18.95 v78.33,18.85
  Bottom 0.254: v78.33,18.85 74.59,22.59 65.69,22.59 65.53,22.43 64.92,22.43 64.77,22.64 61.53,22.62 61.01,23.02 60.91,23.02 v60.86,23.07
LM  (via drill 0.35)
  Top 0.254: U1.9 78.31,12.39 v78.31,12.65 | v66.52,11.4 66.52,11.43 62.81,15.14 v62.78,15.14 | v57.12,23.6 52.29,26.53 40.38,26.52 36.42,23.48 v36.42,23.45 | v18.06,15.3 18.06,14.38 19.05,14.06 26.18,14.08 30.48,17.18 v30.56,17.18
  Bottom 0.254: v78.31,12.65 78,12.65 76.75,11.4 v66.52,11.4 | v57.12,23.6 57.12,22.27 59.36,20.04 59.38,20 62.78,16.61 v62.78,15.14 | v36.42,23.45
  Bottom 0.406: v36.42,23.45 30.56,18.87 v30.56,17.18 | U$3.OUT 14.99,20.23 15.72,19.49 15.72,17.64 v18.06,15.3
MOTOR+  (via drill 0.35)
  Top 0.406: U1.25 77.57,21.03 77.7,21.03 78.08,21.41 v78.46,21.41 | v81.75,24.29 81.75,24.61 82.49,25.05 R7.1
  Bottom 0.406: v78.46,21.41 79.22,21.41 80.17,22.36 v81.75,24.29
MOTOR-HEADER  (via drill 0.35)
  Top 0.406: v86.65,17.22 86.65,17.09 89.23,11.87 89.5,11.33 U$1.MOTOR | v85.92,25.06 R7.2
  Bottom 0.406: v85.92,25.06 85.92,17.95 v86.65,17.22
N$1
  Top 0.254: R1.2 76.11,8.77 76.3,8.77 76.36,8.71
  Top 0.305: 76.36,8.71 R2.2 78.86,9.61 81.11,9.61 Q1.1
N$2
  Top 0.305: U1.20 82.72,19.13 83.21,19.13 83.88,19.81 C6.2
N$3
  Top 0.254: Q2.1 71.58,23.69 R4.2 71.41,23.52 R3.2
N$4
  Top 0.254: U1.7 77.17,11.37 76.74,10.94 75.2,10.94 74.52,11.62 74.52,11.94 74.51,11.95 74.52,12.03 74.52,12.07 74.25,12.35 Y1.IN
N$5
  Top 0.254: U$2.FT 20.67,24.32 TP1.P$1
N$6
  Top 0.254: U1.8 77.29,10.31 74.52,10.31 74.38,10.45 Y1.OUT
N$7
  Top 0.508: U$4.P$4 27.81,25.99 R8.2
N$10
  Top 0.406: C2.2 12.55,12.63
  Top 1.016: 12.55,12.63 12.55,11.95 12.55,11.29 U2.5
N$11
  Top 0.254: U$4.P$3 27.46,27.19 | 29.54,26.96 R11.2
  Top 0.508: 29.54,26.96 28.78,26.96 28.55,27.19 27.46,27.19
N$17
  pour Top: 31.52,16.4 41.5,22.59 42.01,22.87 42.74,23.08 43.62,23.21 44.59,23.26 45.57,23.23 46.5,23.11 47.32,22.89 47.96,22.59 58.05,16.28 58.41,15.95 58.64,15.56 58.77,15.12 58.78,14.66 58.71,14.21 58.56,13.78 58.34,13.39 58.06,13.08 49.78,7.82 48.71,7.1 47.57,6.56 46.38,6.21 45.13,6.05 43.85,6.08 42.53,6.33 41.2,6.8 39.87,7.5 31.22,12.98 30.83,13.28 30.55,13.67 30.37,14.11 30.32,14.6 30.4,15.09 30.62,15.57 30.99,16.02
N$19
  pour Bottom: 83.76,20.82 83.76,22.11 83.77,22.17 83.79,22.24 83.82,22.29 83.86,22.34 83.91,22.38 83.96,22.41 84.03,22.43 84.09,22.44 84.57,22.44 84.64,22.43 84.7,22.41 84.76,22.38 84.81,22.34 84.85,22.29 84.88,22.24 84.9,22.17 84.9,22.11 84.9,20.82 84.9,20.75 84.88,20.69 84.85,20.63 84.81,20.58 84.76,20.54 84.7,20.51 84.64,20.49 84.57,20.49 84.09,20.49 84.03,20.49 83.96,20.51 83.91,20.54 83.86,20.58 83.82,20.63 83.79,20.69 83.77,20.75
N$20
  pour Bottom: 87.19,20.58 88.48,20.58 88.54,20.57 88.61,20.55 88.66,20.52 88.71,20.48 88.75,20.43 88.78,20.37 88.8,20.31 88.81,20.24 88.81,19.76 88.8,19.7 88.78,19.64 88.75,19.58 88.71,19.53 88.66,19.49 88.61,19.46 88.54,19.44 88.48,19.43 87.19,19.43 87.12,19.44 87.06,19.46 87,19.49 86.95,19.53 86.91,19.58 86.88,19.64 86.86,19.7 86.86,19.76 86.86,20.24 86.86,20.31 86.88,20.37 86.91,20.43 86.95,20.48 87,20.52 87.06,20.55 87.12,20.57
N$21
  pour Bottom: 91.84,20.58 93.13,20.58 93.2,20.57 93.26,20.55 93.32,20.52 93.37,20.48 93.41,20.43 93.44,20.37 93.46,20.31 93.46,20.24 93.46,19.76 93.46,19.7 93.44,19.64 93.41,19.58 93.37,19.53 93.32,19.49 93.26,19.46 93.2,19.44 93.13,19.43 91.84,19.43 91.78,19.44 91.71,19.46 91.66,19.49 91.61,19.53 91.57,19.58 91.54,19.64 91.52,19.7 91.51,19.76 91.51,20.24 91.52,20.31 91.54,20.37 91.57,20.43 91.61,20.48 91.66,20.52 91.71,20.55 91.78,20.57
N$22
  pour Bottom: 78.36,25.76 79.65,25.76 79.71,25.75 79.78,25.73 79.83,25.7 79.88,25.66 79.92,25.61 79.95,25.55 79.97,25.49 79.98,25.42 79.98,24.95 79.97,24.88 79.95,24.82 79.92,24.76 79.88,24.71 79.83,24.67 79.78,24.64 79.71,24.62 79.65,24.61 78.36,24.61 78.29,24.62 78.23,24.64 78.17,24.67 78.12,24.71 78.08,24.76 78.05,24.82 78.03,24.88 78.02,24.95 78.02,25.42 78.03,25.49 78.05,25.55 78.08,25.61 78.12,25.66 78.17,25.7 78.23,25.73 78.29,25.75
N$23
  pour Bottom: 68.87,25.89 70.16,25.89 70.23,25.88 70.29,25.86 70.35,25.83 70.39,25.79 70.44,25.74 70.47,25.68 70.49,25.62 70.49,25.56 70.49,25.08 70.49,25.01 70.47,24.95 70.44,24.89 70.39,24.84 70.35,24.8 70.29,24.77 70.23,24.75 70.16,24.74 68.87,24.74 68.8,24.75 68.74,24.77 68.69,24.8 68.64,24.84 68.6,24.89 68.56,24.95 68.55,25.01 68.54,25.08 68.54,25.56 68.55,25.62 68.56,25.68 68.6,25.74 68.64,25.79 68.69,25.83 68.74,25.86 68.8,25.88
N$24
  pour Bottom: 64.95,25.89 66.24,25.89 66.31,25.88 66.37,25.86 66.43,25.83 66.48,25.79 66.52,25.74 66.55,25.68 66.57,25.62 66.57,25.56 66.57,25.08 66.57,25.01 66.55,24.95 66.52,24.89 66.48,24.84 66.43,24.8 66.37,24.77 66.31,24.75 66.24,24.74 64.95,24.74 64.89,24.75 64.82,24.77 64.77,24.8 64.72,24.84 64.68,24.89 64.65,24.95 64.63,25.01 64.62,25.08 64.62,25.56 64.63,25.62 64.65,25.68 64.68,25.74 64.72,25.79 64.77,25.83 64.82,25.86 64.89,25.88
N$25
  pour Bottom: 31.52,16.4 41.5,22.59 42.01,22.87 42.74,23.08 43.62,23.21 44.59,23.26 45.57,23.23 46.5,23.11 47.32,22.89 47.96,22.59 58.05,16.28 58.41,15.95 58.64,15.56 58.77,15.12 58.78,14.66 58.71,14.21 58.56,13.78 58.34,13.39 58.06,13.08 49.78,7.82 48.71,7.1 47.57,6.56 46.38,6.21 45.13,6.05 43.85,6.08 42.53,6.33 41.2,6.8 39.87,7.5 31.22,12.98 30.83,13.28 30.55,13.67 30.37,14.11 30.32,14.6 30.4,15.09 30.62,15.57 30.99,16.02
OE  (via drill 0.35)
  Top 0.305: U1.13 81.65,13.58 81.15,13.58 78.29,16.67 v78.13,16.67 | v45.52,4 45.48,4.09 41.38,4.07 31.72,10.45 25.78,10.47 22.91,13.34 19.17,13.35 17.42,13.9 17.43,18.45 18.59,19.62 19.48,19.62 v19.53,19.57
  Bottom 0.305: v78.13,16.67 77.84,16.67 74.14,13.12 61.06,13.16 59.74,12.19 57.76,12.14 45.53,3.99 v45.52,4
  Bottom 0.406: U$3.OE 19.2,20.23 19.53,19.9 v19.53,19.57
RST
  Top 0.254: 64.07,16.66 63.35,17.38 | C7.2 69.06,20.3 74.17,20.3 74.99,19.48 74.99,19.1 U1.29
  Top 0.305: ICSP.3 31.68,6.02 38.43,1.26 65.63,1.25 68.69,4.23 70.46,4.23 71.01,4.78 71.01,7.82 63.52,15.3 63.52,16.11 64.07,16.66 67.75,20.34 C7.2 | 63.35,17.38 63.35,18.34 62.82,18.87 62.82,24.69 R12.1
RXD  (via drill 0.35)
  Top 0.254: v79.01,13.46 79.01,14.93 76.56,17.37 75.59,17.37 U1.30 | v27.51,2.68 26.74,2.68 25.36,1.15 8.61,1.16 0.85,8.42 0.85,10.64 5.28,15.07 8.78,15.07 9.52,15.81 9.52,15.82 J1.4
  Bottom 0.305: v79.01,13.46 78.98,13.44 78.98,12.39 78.6,12 77.99,12 77.56,11.58 76.69,10.69 72.85,10.69 64.1,1.95 28.19,1.95 27.51,2.63 v27.51,2.68
S1  (via drill 0.35)
  Top 0.254: ICSP.1 27.37,7.74 31.56,7.74 40.24,1.79 65.43,1.79 68.12,4.48 v68.12,4.96
  Top 0.305: U1.16 84.49,15.5 85.38,15.5 v85.76,15.12
  Top 0.406: v87.83,18.64 88.66,18.64 89.43,19.41 89.43,20.65 88.8,21.28 S1+.P$1
  Bottom 0.254: v85.76,15.12 87.03,15.12 87.83,15.92 v87.83,18.64
  Bottom 0.305: v85.76,15.12 78.19,7.62 70.76,7.6 v68.12,4.96
S3
  Top 0.406: U1.12 82.47,11.63 85.65,11.63 88.21,7.74 91.74,7.74 U$1.S3
S5
  Top 0.254: U1.11 81.05,11.94
  Top 0.406: 81.05,11.94 81.89,11.03 85.16,11.03 87.77,6.92 U$1.S5
S8@2.5V  (via drill 0.35)
  Top 0.254: U1.24 79.18,19.91 v78.92,18.25 | 25.13,20.95 R10.1 25.12,20.29 25.61,19.8 v26.31,19.8
  Top 0.305: R9.2 23.06,20.14 24.8,20.14 25.13,20.47 25.13,20.95 | v64.33,20.55 v65.4,21.75
  Bottom 0.254: v78.92,18.25 78.74,18.07 78.22,18.07 76.73,19.65 74.28,20.03 72.08,22.18 65.91,22.18 65.46,21.8 v65.4,21.75 | v26.31,19.8 26.45,19.8
  Bottom 0.305: 26.45,19.8 32.14,25.48 57.12,25.33 58.73,24.04 58.76,22.77 60.22,21.29 63.97,21.32 64.33,20.96 v64.33,20.55
S8@6V  (via drill 0.35)
  Top 0.254: v69.1,4.96 69.1,7.23 54.32,21.92 51.35,23.92 42.4,23.97 36.55,20.15 27.68,20.15 26.56,19.11 R9.1
  Top 0.813: v90.04,17.13 U$1.S8
  Bottom 0.305: v90.04,17.13 90.04,15.97 86.26,12.19 86.26,9.6 85.63,9.05 85.59,9.03 82.12,9.03 78.81,5.79 73.85,5.85 73.11,6.72 70.69,6.72 70.59,6.71 69.1,5.27 v69.1,4.96
S9@2.5V  (via drill 0.35)
  Top 0.254: R5.2 20.55,16.33 22.52,16.33 22.9,16.71 22.9,17.22 | v79.57,17.56 79.5,19.26 U1.23 | v64.59,19.69 64.67,19.69 66.22,21.24 v66.22,21.57
  Top 0.305: v26.46,16.93 26.03,16.5 23.68,16.5 R6.1 22.9,17.22
  Bottom 0.254: v79.57,17.56 78.1,17.56 77.47,18.18 76.91,18.72 74.46,19.08 71.97,21.57 v66.21,21.57 v66.22,21.57
  Bottom 0.305: v26.46,16.93 26.46,19.03 32.26,24.83 56.87,24.86 58,23.66 58.02,22.65 59.88,20.82 63.08,20.83 64.21,19.69 v64.59,19.69
S9@6V  (via drill 0.35)
  Top 0.254: v62.04,16.32 62.12,16.24 62.12,14.89 70.11,6.87 70.11,4.99 v70.16,4.99
  Top 0.305: v26.61,15.46 21.2,15.46 R5.1
  Top 0.813: v92.05,16.58 U$1.S9
  Bottom 0.254: v26.61,15.46 27.19,16.04 27.19,18.88 32.62,24.3 56.28,24.34 56.36,22.2 62.04,16.52 v62.04,16.32
  Bottom 0.305: v92.05,16.58 87,11.53 87,9.06 86.29,8.35 86.23,8.33 82.52,8.33 79.22,5.21 73.6,5.21 73.37,5.47 72.85,6.03 70.96,6.03 70.16,5.23 v70.16,4.99
SDA_S2  (via drill 0.35)
  Top 0.254: v63.94,23.93 64.02,24.01 66.55,24.01 67.77,22.79 74.29,22.79 74.57,22.51 75.16,22.51 75.16,21.2 U1.27
  Top 0.305: S2+.P$1 64.54,26.6 63.94,25.92 v63.94,23.93 | J1.2 10.52,18.78 12.6,20.86 12.65,20.86 v12.65,20.96
  Bottom 0.254: v63.94,23.93 61.94,23.93 61.21,24.67 58.96,24.67 57.56,25.93 31.86,25.93 29.57,23.79 25.71,23.79 24.71,22.79 14.48,22.79 v12.65,20.96
SOL1
  Top 0.254: U1.1 72.48,13.42 70.79,13.41 70.79,10.12 72.21,8.7 74.3,8.7
  Top 0.305: 74.3,8.7 R1.1
SOL1-
  Top 0.254: 81.99,5.88 D1.A
  Top 0.813: Q1.3 83.62,7.56 82.84,5.88 81.99,5.88 80.06,5.88 79.98,5.84 SOL1.SOL1-
SOL2  (via drill 0.35)
  Top 0.254: v27.32,22.15 35.83,22.13 40.95,26.03 51.84,26.04 57.13,22.72 59,22.7 v60.06,23.76 | v65.18,23.29 66.41,23.29 67.7,22 R3.1
  Top 0.406: v83,15.79 82.56,14.96 U1.15
  Bottom 0.254: v83,15.79 82.38,15.79 75.03,23 65.38,23.01 65.18,23.21 v65.18,23.29 65.15,23.26 61.86,23.26 61.37,23.76 60.04,23.76 v60.06,23.76 | ICSP.5 28.74,11.06 25.62,14.17 25.62,20.46 v27.32,22.15
SOL2-
  Top 0.813: SOL2-.P$1 78.23,26.32 arc90 77.44,25.54 | 77.44,25.54 77.44,24.14 76.51,23.21 Q2.3 | D2.A 77.44,25.79 77.44,25.54
TXD  (via drill 0.35)
  Top 0.254: v26.36,11.23 26.4,11.27 31.78,11.26 42.14,4.67 46.42,4.68 60.48,13.98 60.65,13.98 v60.83,13.8 | U1.31 74.3,17.5 74.24,17.53
  Top 0.305: 74.24,17.53 73.95,17.95 73.36,17.88 v72.55,16.99 | v8,21.8 9.02,20.78 J1.5
  Bottom 0.254: v72.55,16.99 71.7,16.06 69.52,16.06 67.82,14.45 67.14,13.81 63.35,13.81 60.84,13.81 v60.83,13.8
  Bottom 0.406: v8,21.8 7.63,21.43 7.63,14.96 13.18,9.41 21.43,9.41 23.26,11.23 v26.36,11.23

### Text on the board
Top: top
Bottom: bottom
Dimension: CUT OUT | CUT OUT | CUT OUT | CUT OUT | CUT OUT | CUT OUT | CUT OUT | CUT OUT
tPlace: S2+ | S2- | C | USB / FTDI | F+ | FF | F- | SOL2- | 20191127 | Q2 | layout 7.9.1 | TP-FT | S1+ | SOL2+ | S1- | DTR | TXD | RXD | VCC | GND | U1 | S8 | S9 | 1W | VCC-6V | MOTOR | X1 | X1 | 3.3V | VCC | MOSI | GND | GND | 3.3V | S3 | GND | Q1 | S5 | 6V | C | MISO | SCK | RST | 6V | EDWIN / TSL237T | SOL1+ | SOL1-
bPlace: www.openSX70.com | layout 7.7 | 1 | LIGHT / METER | VCC | MOSI | GND | ICSP / BOTTOM | MISO | SCK | RST | EDWIN
tNames: A+ | LED | + | + | + | + | +
tDocu: Creative Commons "Attribution-NonCommercial 4.0 International (CC BY-NC 4.0)" / https://creativecommons.org/licenses/by-nc/4.0/ | ALL VIAS TENTED | 0.6mm width PCB | FLAT / CABLE | openSX70 project visit www.openSX70.com / version 7.8 "EDWIN TSL237T" 20191123 / IMPORTANT: 0.6mm width PCB!!!! / SILKSCREEN AND REGISTRATION IS SPECIALLY IMPORTANT! / / by Joaquín de Prada